# Altium project ArDINo DINOBUS NODE CONTROLLER.PrjPCB
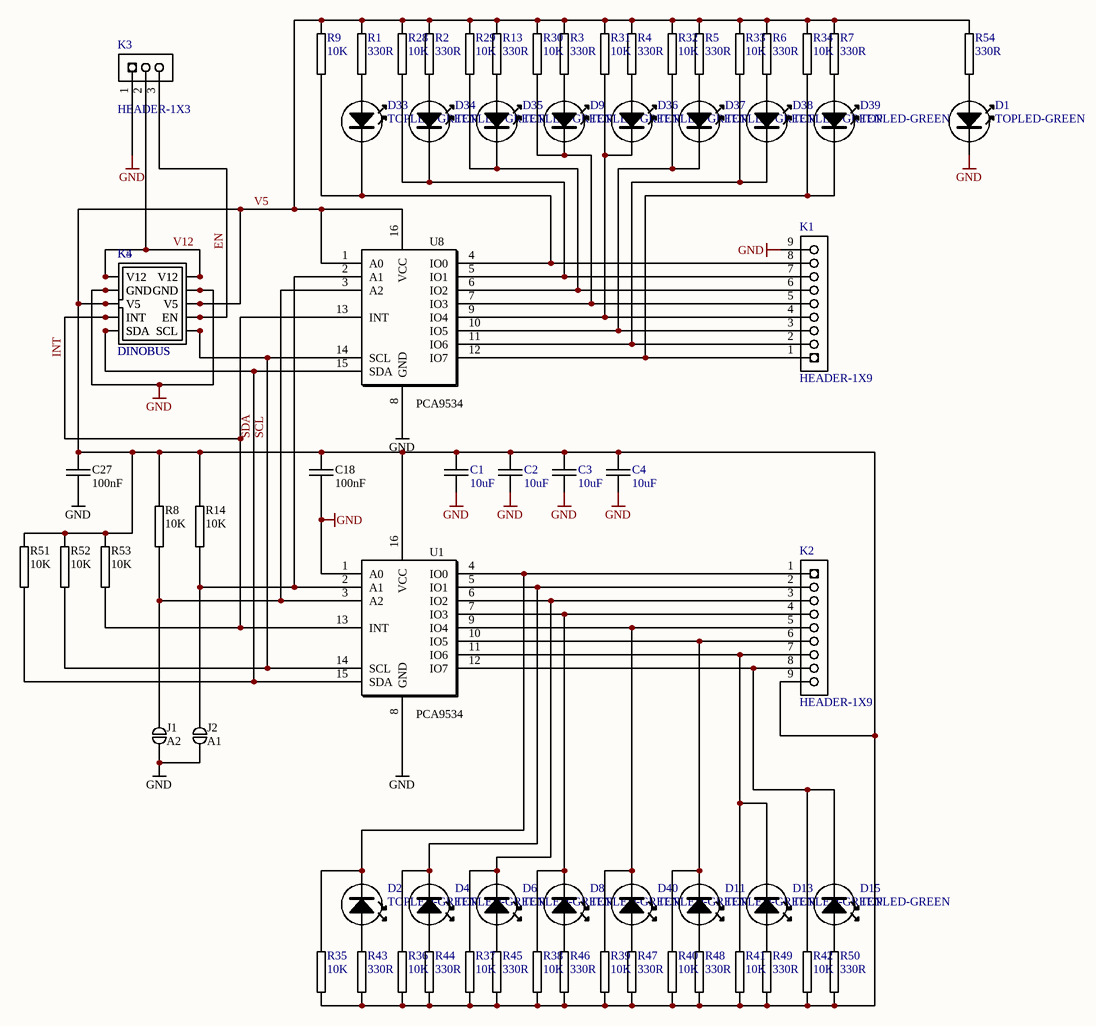
[diagram p0: DINOBUS NODE CONTROLLER.SchDoc]
1 sheet, 70 parts. Net scope: global (net labels, ports and power ports of the same name join across sheets).
Board file: DINOBUS NODE CONTROLLER.PcbDoc

## Sheet DINOBUS NODE CONTROLLER.SchDoc: document title
size C; ApprovedBy: Vincent Himpe; CheckedBy: Vincent Himpe; Author: Vincent Himpe; CompanyName: STMicroelectronics; DrawnBy: Vincent Himpe; Organization: BCD Application; Address1: 2525 Augustine Drive; Address2: Santa Clara 95054 CA; Address3: USA; Revision: A; Project: Project title; DrawnByContact: +1 (408) 451 8116; DrawnByEmail: vincent.himpe@st.com

### Parts
C1  10uF  [0805C-GENERIC]
C2  10uF  [0805C-GENERIC]
C3  10uF  [0805C-GENERIC]
C4  10uF  [0805C-GENERIC]
C18  100nF  [0805C]
C27  100nF  [0805C]
D1  TOPLED-GREEN  [TOPLED-GREEN]
D2  TOPLED-GREEN  [TOPLED-GREEN]
D4  TOPLED-GREEN  [TOPLED-GREEN]
D6  TOPLED-GREEN  [TOPLED-GREEN]
D8  TOPLED-GREEN  [TOPLED-GREEN]
D9  TOPLED-GREEN  [TOPLED-GREEN]
D11  TOPLED-GREEN  [TOPLED-GREEN]
D13  TOPLED-GREEN  [TOPLED-GREEN]
D15  TOPLED-GREEN  [TOPLED-GREEN]
D33  TOPLED-GREEN  [TOPLED-GREEN]
D34  TOPLED-GREEN  [TOPLED-GREEN]
D35  TOPLED-GREEN  [TOPLED-GREEN]
D36  TOPLED-GREEN  [TOPLED-GREEN]
D37  TOPLED-GREEN  [TOPLED-GREEN]
D38  TOPLED-GREEN  [TOPLED-GREEN]
D39  TOPLED-GREEN  [TOPLED-GREEN]
D40  TOPLED-GREEN  [TOPLED-GREEN]
J1  A2  [BYPASS]
J2  A1  [BYPASS]
K1  HEADER-1X9  [HEADER-1X9]
K2  HEADER-1X9  [HEADER-1X9]
K3  HEADER-1X3  [HEADER-1X3]
K4  DINOBUS  [IDC10-B]
K5  DINOBUS  [IDC10-B]
R1  330R  [0805R-330]
R2  330R  [0805R-330]
R3  330R  [0805R-330]
R4  330R  [0805R-330]
R5  330R  [0805R-330]
R6  330R  [0805R-330]
R7  330R  [0805R-330]
R8  10K  [0805R]
R9  10K  [0805R-10K]
R13  330R  [0805R-330]
R14  10K  [0805R]
R28  10K  [0805R-10K]
R29  10K  [0805R-10K]
R30  10K  [0805R-10K]
R31  10K  [0805R-10K]
R32  10K  [0805R-10K]
R33  10K  [0805R-10K]
R34  10K  [0805R-10K]
R35  10K  [0805R-10K]
R36  10K  [0805R-10K]
R37  10K  [0805R-10K]
R38  10K  [0805R-10K]
R39  10K  [0805R-10K]
R40  10K  [0805R-10K]
R41  10K  [0805R-10K]
R42  10K  [0805R-10K]
R43  330R  [0805R-330]
R44  330R  [0805R-330]
R45  330R  [0805R-330]
R46  330R  [0805R-330]
R47  330R  [0805R-330]
R48  330R  [0805R-330]
R49  330R  [0805R-330]
R50  330R  [0805R-330]
R51  10K  [0805R]
R52  10K  [0805R]
R53  10K  [0805R]
R54  330R  [0805R-330]
U1  PCA9534  [SO16W]
U8  PCA9534  [SO16W]

### Nets
GND: C1.2 C2.2 C3.2 C4.2 C18.2 C27.2 D1.K J1.2 J2.2 K1.9 K3.1 K4.3(GND) K4.4(GND) K5.3(GND) K5.4(GND) U1.1(A0) U1.8(GND) U8.8(GND)
EN: K3.3 K4.8(EN) K5.8(EN)
INT: K4.7(INT) K5.7(INT) R53.1 U1.13(INT) U8.13(INT)
SCL: K4.10(SCL) K5.10(SCL) R52.1 U1.14(SCL) U8.14(SCL)
SDA: K4.9(SDA) K5.9(SDA) R51.1 U1.15(SDA) U8.15(SDA)
V5: C1.1 C2.1 C3.1 C4.1 C18.1 C27.1 K2.9 K4.5(V5) K4.6(V5) K5.5(V5) K5.6(V5) R1.2 R2.2 R3.2 R4.2 R5.2 R6.2 R7.2 R8.2 R9.2 R13.2 R14.2 R28.2 R29.2 R30.2 R31.2 R32.2 R33.2 R34.2 R35.2 R36.2 R37.2 R38.2 R39.2 R40.2 R41.2 R42.2 R43.2 R44.2 R45.2 R46.2 R47.2 R48.2 R49.2 R50.2 R51.2 R52.2 R53.2 R54.2 U1.16(VCC) U8.1(A0) U8.16(VCC)
V12: K3.2 K4.1(V12) K4.2(V12) K5.1(V12) K5.2(V12)
NetD1_A: D1.A R54.1
NetD2_A: D2.A R43.1
NetD2_K: D2.K K2.1 R35.1 U1.4(IO0)
NetD4_A: D4.A R44.1
NetD4_K: D4.K K2.2 R36.1 U1.5(IO1)
NetD6_A: D6.A R45.1
NetD6_K: D6.K K2.3 R37.1 U1.6(IO2)
NetD8_A: D8.A R46.1
NetD8_K: D8.K K2.4 R38.1 U1.7(IO3)
NetD9_A: D9.A R3.1
NetD9_K: D9.K K1.5 R30.1 U8.7(IO3)
NetD11_A: D11.A R48.1
NetD11_K: D11.K K2.6 R40.1 U1.10(IO5)
NetD13_A: D13.A R49.1
NetD13_K: D13.K K2.7 R41.1 U1.11(IO6)
NetD15_A: D15.A R50.1
NetD15_K: D15.K K2.8 R42.1 U1.12(IO7)
NetD33_A: D33.A R1.1
NetD33_K: D33.K K1.8 R9.1 U8.4(IO0)
NetD34_A: D34.A R2.1
NetD34_K: D34.K K1.7 R28.1 U8.5(IO1)
NetD35_A: D35.A R13.1
NetD35_K: D35.K K1.6 R29.1 U8.6(IO2)
NetD36_A: D36.A R4.1
NetD36_K: D36.K K1.4 R31.1 U8.9(IO4)
NetD37_A: D37.A R5.1
NetD37_K: D37.K K1.3 R32.1 U8.10(IO5)
NetD38_A: D38.A R6.1
NetD38_K: D38.K K1.2 R33.1 U8.11(IO6)
NetD39_A: D39.A R7.1
NetD39_K: D39.K K1.1 R34.1 U8.12(IO7)
NetD40_A: D40.A R47.1
NetD40_K: D40.K K2.5 R39.1 U1.9(IO4)
NetJ1_1: J1.1 R8.1 U1.3(A2) U8.3(A2)
NetJ2_1: J2.1 R14.1 U1.2(A1) U8.2(A1)

### Notes on the sheet
- PROJECT
- STMicroelectronics
- Last Modified
- Sheet
- of
- Document
- Revision
- Drawn By
- Information in this document is the intellectual property of STMicroelectronics.Disclosure outside of STMicroelectronics is prohibited without prior written approval. Contents may be subject to Patent or Patent application.
- 2525 Augustine Drive
- Santa Clara 95054 CA
- USA

### Library data of the parts
C1-C4 = 0805C-10UF-16V-X5R-TDK: CAPACITOR 0805 CERAMIC; Manufacturer Part Number: C2012X5R1C106M; Manufacturer: TDK Corporation; REEL: C63; Description: CAP CER 10UF 16V X5R 0805; Supplier 1: Digi-Key; Supplier Part Number 1: 445-4115-2-ND
C18 C27 = 0805C-100NF: CAPACITOR NONPOLARISED
J1 J2 = BYPASS
K4 K5 = DINOBUS: BOXHEADER 10 PIN; Manufacturer: Assmann Electronics Inc; Manufacturer Part Number: AWHW10G-0202-T-R; Connector Type: Header, Shrouded; Description: CONN HEADER LOW-PRO 10POS GOLD; Number of Positions: 10; Number of Positions Loaded: All; Pitch: 0.100" (2.54mm); Supplier 1: Digi-Key; Supplier Part Number 1: HRP10H-ND; Supplier: Digi-Key; Contact Type: Male Pin; RoHS: RoHS Compliant; Supplier Part Number: HRP10H-ND; Category: Connectors, Interconnects; Number of Rows: 2; Row Spacing: 0.100" (2.54mm); Contact Mating Length: -; Mounting Type: Through Hole; Termination: Solder; Fastening Type: -; Features: -; Contact Finish: Gold; Contact Finish Thickness: Flash; Color: Gray; Packaging: Tray
R1-R7 R13 R43-R50 R54 = 0805R-330: RESISTOR 0805 1/4 WATT THIN FILM; Reel: *
R8 R14 R51-R53 = 0805R-10K: RESISTOR VALUE AS INDICATED
R9 R28-R42 = 0805R-10k: RESISTOR 0805 1/4 WATT THIN FILM; Reel: *
U1 U8 = PCA9534: OCTAL PUSH PULL DRIVER I2C
K1 K2 = HEADER-1X9: Supplier 1: Digi-Key; Supplier Part Number 1: S1011E-36-ND
K3 = HEADER-1X3: Supplier 1: Digi-Key; Supplier Part Number 1: S1011E-36-ND